# EasyEDA schematic SCH_6502 copy_2025-03-02.json
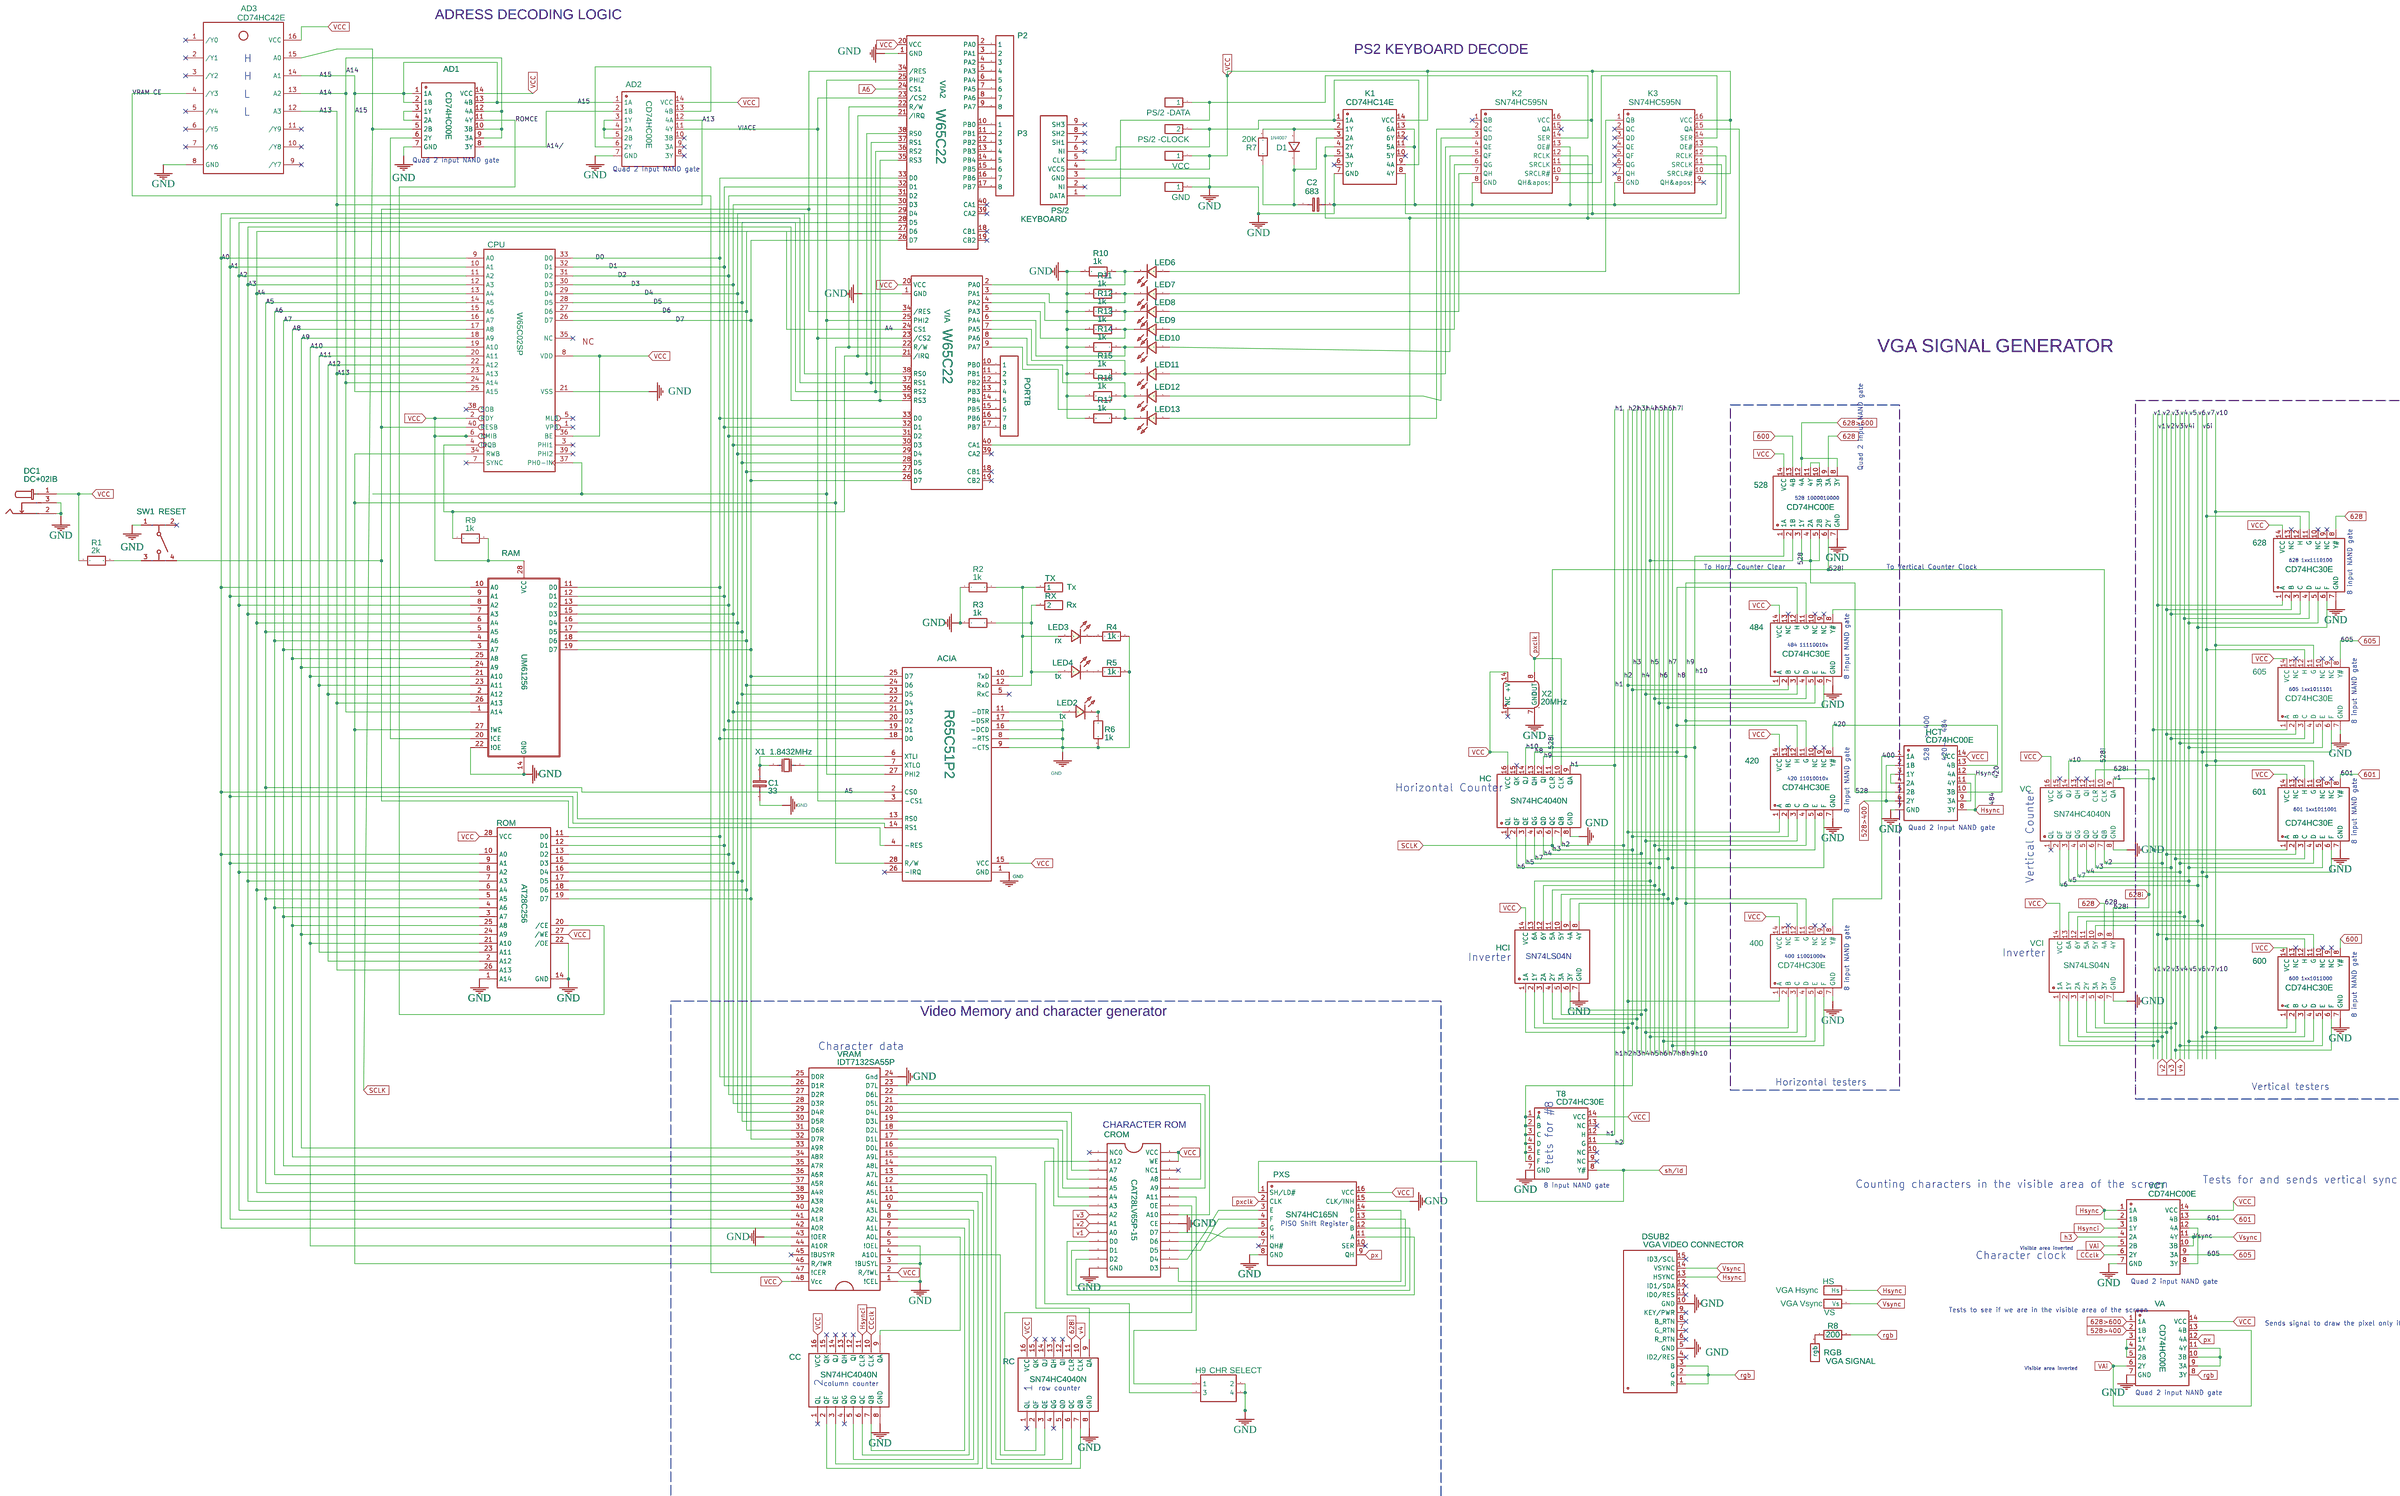
[diagram p0: schematic sheet]

## Parts
400  CD74HC30E  [DIP-14_L19.0-W7.0-P2.54-LS7.6-BL]
420  CD74HC30E  [DIP-14_L19.0-W7.0-P2.54-LS7.6-BL]
484  CD74HC30E  [DIP-14_L19.0-W7.0-P2.54-LS7.6-BL]
528  CD74HC00E  [DIP14]
600  CD74HC30E  [DIP-14_L19.0-W7.0-P2.54-LS7.6-BL]
601  CD74HC30E  [DIP-14_L19.0-W7.0-P2.54-LS7.6-BL]
605  CD74HC30E  [DIP-14_L19.0-W7.0-P2.54-LS7.6-BL]
628  CD74HC30E  [DIP-14_L19.0-W7.0-P2.54-LS7.6-BL]
ACIA  R65C51P2  [DIP28-600]
AD1  CD74HC00E  [DIP14]
AD2  CD74HC00E  [DIP14]
AD3  CD74HC42E  [DIP16-2.54-19.2X7.62MM]
C1  33  [RAD-0.2]
C2  683  [RAD-0.2]
CC  SN74HC4040N  [DIP254P762X508-16]
CLK  PS/2 -CLOCK  [HDR-M-2.54_1X1]
CPU  W65C02SP  [DIP-40]
CROM  CAT28LV65P-15  [DIP-28]
D1  1N4007  [DO-41_BD2.4-L4.7-P8.70-D0.9-RD]
DATA  PS/2 -DATA  [HDR-M-2.54_1X1]
DC1  DC+02IB  [AUDIO-SMD_DC-02IB]
DSUB2  VGA VIDEO CONNECTOR  [VGA-002]
GND  GND  [HDR-M-2.54_1X1]
H9  CHR SELECT  [HDR-F-2.54_2X2]
HC  SN74HC4040N  [DIP16]
HCI  U39  [PDIP-14_L19.7-W6.6-P2.54-LS8.3-BL]
HCT  CD74HC00E  [DIP14]
HS  VGA Hsync  [HDR-M-2.54_1X1]
K1  CD74HC14E  [DIP14]
K2  SN74HC595N  [DIP-16_L19.8-W6.5-P2.54-LS7.6-BL]
K3  SN74HC595N  [DIP-16_L19.8-W6.5-P2.54-LS7.6-BL]
KEYBOARD  PS/2  [PS2 FEMALE]
LED2  tx  [LED-TH_BD3.0_RED]
LED3  rx  [LED-TH_BD3.0_BLUE]
LED4  tx  [LED-TH_BD3.0_RED]
LED6  LED-TH-3mm_R  [LED-TH_BD3.0_RED]
LED7  LED-TH-3mm_R  [LED-TH_BD3.0_RED]
LED8  LED-TH-3mm_R  [LED-TH_BD3.0_RED]
LED9  LED-TH-3mm_R  [LED-TH_BD3.0_RED]
LED10  LED-TH-3mm_R  [LED-TH_BD3.0_RED]
LED11  LED-TH-3mm_R  [LED-TH_BD3.0_RED]
LED12  LED-TH-3mm_R  [LED-TH_BD3.0_RED]
LED13  LED-TH-3mm_R  [LED-TH_BD3.0_RED]
P2  HDR-F-2.54_1x8  [HDR-F-2.54_1X8]
P3  P3  [HDR-F-2.54_1X8]
PORTB  HDR-F-2.54_1x8  [HDR-F-2.54_1X8]
PXS  SN74HC165N  [DIP-16_L19.8-W6.5-P2.54-LS7.6-BL]
R1  2k  [R_AXIAL-0.4]
R2  1k  [R_AXIAL-0.3]
R3  1k  [R_AXIAL-0.3]
R4  1k  [R_AXIAL-0.4]
R5  1k  [R_AXIAL-0.4]
R6  1k  [R_AXIAL-0.4]
R7  20K  [R_AXIAL-0.4]
R8  200  [R_AXIAL-0.4]
R9  1k  [R_AXIAL-0.3]
R10  1k  [R_AXIAL-0.4]
R11  1k  [R_AXIAL-0.4]
R12  1k  [R_AXIAL-0.4]
R13  1k  [R_AXIAL-0.4]
R14  1k  [R_AXIAL-0.4]
R15  1k  [R_AXIAL-0.4]
R16  1k  [R_AXIAL-0.4]
R17  1k  [R_AXIAL-0.4]
RAM  UM61256  [DIP-28_300MIL]
RC  SN74HC4040N  [DIP254P762X508-16]
RGB  VGA SIGNAL  [HDR-M-2.54_1X1]
ROM  AT28C256  [AT28C256]
RX  Rx  [HDR-M-2.54_1X1]
SW1  RESET  [SW-TH_4P-L6.0-W6.0-P4.50-LS6.1]
T8  CD74HC30E  [DIP-14_L19.0-W7.0-P2.54-LS7.6-BL]
TX  Tx  [HDR-M-2.54_1X1]
VA  CD74HC00E  [DIP14]
VC  SN74HC4040N  [DIP16]
VCC  VCC  [HDR-M-2.54_1X1]
VCI  SN74LS04N  [PDIP-14_L19.7-W6.6-P2.54-LS8.3-BL]
VCT  CD74HC00E  [DIP14]
VIA  W65C22  [DIP-40_W15.24MM_LONGPADS_OWN]
VIA2  W65C22  [DIP-40_W15.24MM_LONGPADS_OWN]
VRAM  IDT7132SA55P  [DIP-48_W15.24MM_LONGPADS]
VS  VGA Vsync  [HDR-M-2.54_1X1]
X1  1.8432MHz  [OSC-TH_L10.0-W4.5-P5.00]
X2  20MHz  [OSCILLATOR_DIP-14]

## Library data of the parts
400 420 484 600 601 605 628 T8 = CD74HC30E: Supplier: LCSC; Supplier Part: C133818; Manufacturer: Texas Instruments; Contributor: LCSC; JLCPCB Part Class: Extended Part
528 AD1 AD2 HCT VA VCT = CD74HC00E
ACIA = R6551_ACIA copy: Manufacturer Part: 6551 ACIA; Contributor: MCCreeper8890
AD3 = CD74HC42E: Contributor: Károly Elekes
C1 C2 = C_RAD-0.2_EU: Contributor: LCEDA_Lib
CC RC = SN74HC4040N: Contributor: Niels Tatters
CLK DATA GND HS RGB RX TX VCC VS = HDR-M-2.54_1x1: Supplier Part: C81276; Supplier: LCSC; Contributor: LCEDA_Lib
CPU = W65C02SP
CROM = CAT28C64AP-20: Manufacturer: CATALYST SEMICONDUCTOR INC.; Supplier: eBay; Contributor: Felix Hower
D1 = 1N4007: Supplier: LCSC; Manufacturer: SEMTECH; Supplier Part: C106903; Contributor: LCEDA_Lib
DC1 = DC+02IB: Supplier: LCSC; Supplier Part: C718035; Manufacturer: JINJIA(金佳); JLCPCB Part Class: Extended Part; Contributor: LCSC
DSUB2 = VGA VIDEO CONNECTOR: Contributor: PixelCircuit
H9 = HDR-F-2.54_2x2: Supplier Part: C239342; Supplier: LCSC; Contributor: LCEDA_Lib
HC VC = SN74HC4040N
HCI VCI = SN74LS04N: Supplier: LCSC; Supplier Part: C183657; Manufacturer: Texas Instruments; Contributor: LCSC; JLCPCB Part Class: Extended Part
K1 = CD74HC14E
K2 K3 = SN74HC595N: Supplier: LCSC; Manufacturer: TI; Supplier Part: C78711; JLCPCB Part Class: Extended Part
KEYBOARD = PS/2: Supplier: LCSC; Contributor: PPaul63
LED2 LED4 LED6-LED13 = LED-TH-3mm_R: Manufacturer: EVERLIGHT(台湾亿光); Manufacturer Part: 204-10SDRD/S530-A3-L; Supplier Part: C84774; Supplier: LCSC; Contributor: LCEDA_Lib
LED3 = LED-TH-3mm_B: Manufacturer: EVERLIGHT(台湾亿光); Manufacturer Part: 204-10SUBC/S400-A4; Supplier Part: C86881; Supplier: LCSC; Contributor: LCEDA_Lib
P2 P3 PORTB = HDR-F-2.54_1x8: Supplier Part: C225505; Supplier: LCSC; Contributor: LCEDA_Lib
PXS = SN74HC165N: Supplier: LCSC; Manufacturer: TI; Supplier Part: C2909; JLCPCB Part Class: Extended Part
R1 R4-R8 R10-R17 = R_AXIAL-0.4_EU: Contributor: LCEDA_Lib
R2 R3 = R_AXIAL-0.3_EU: Contributor: LCEDA_Lib
R9 = R_AXIAL-0.3_EU: Contributor: LCEDA_Lib; Package Display: No
RAM = UM61256: Contributor: angarsk.forex
ROM = AT28C256: Contributor: doctor720.com
SW1 = Button-6x6x6mm: Supplier Part: C71836; Supplier: LCSC; Manufacturer: BBJ; Manufacturer Part: Switch,6*6*6Plastic head,260G, 0.25mm,Straight line
VIA VIA2 = W65C22 VIA: Manufacturer: Western Design Center; Manufacturer Part: W65C02S; Contributor: Lucoa_Quetz
VRAM = IDT7132SA55P: Contributor: alistair.roe66
X1 = X49UD18432MSD2SC-1: Supplier: LCSC; Manufacturer: YXC; Supplier Part: C2179; JLCPCB Part Class: Extended Part
X2 = AXE25-50-10-4F-5.000MHz: Contributor: digaetano.gemrad; license: https://www.gnu.org/licenses/lgpl-2.1.html

## Nets
GND: 400.7(GND) 420.7(GND) 484.7(GND) 528.7(GND) 600.7(GND) 601.7(GND) 605.7(GND) 628.7(GND) ACIA.1(GND) ACIA.8(-RTS) ACIA.9(-CTS) ACIA.16(-DCD) ACIA.17(-DSR) AD1.7(GND) AD2.7(GND) AD3.8(GND) C1.1 C2.2 CC.8(GND) CPU.21(VSS) CROM.14(GND) CROM.20(CE) DC1.2 DC1.3 DSUB2.5(GND) DSUB2.10(GND) GND.1 H9.2 H9.4 HC.8(GND) HCI.7(GND) HCT.7(GND) K1.7(GND) K1.11(5A) K1.13(6A) K2.8(GND) K2.13(OE#) K3.8(GND) K3.13(OE#) KEYBOARD.3(GND) PXS.8(GND) PXS.15(CLK/INH) R2.1 R3.1 R4.2 R5.2 R6.2 R10.1 R11.1 R12.1 R13.1 R14.1 R15.1 R16.1 R17.1 RAM.14(GND) RAM.22(!OE) RC.8(GND) ROM.1(A14) ROM.14(GND) ROM.22(/OE) SW1.1 T8.7(GND) VA.7(GND) VC.8(GND) VCI.7(GND) VCT.7(GND) VIA.1(GND) VIA2.1(GND) VRAM.1(!CEL) VRAM.3(!BUSYL) VRAM.5(!OEL) VRAM.24(Gnd) VRAM.43(!OER) X2.7(GND)
v1: 601.1(A) 605.1(A) CROM.10(A0) VC.9(QA) VCI.1(1A)
v1i: 600.11(G) 628.1(A) VCI.2(1Y)
v2: CROM.9(A1) VC.7(QB) VCI.3(2A)
v2i: 600.12(H) 601.2(B) 605.2(B) 628.2(B) VCI.4(2Y)
v3: 605.3(C) 628.3(C) CROM.8(A2) VC.6(QC) VCI.5(3A)
v3i: 600.6(F) 601.3(C) VCI.6(3Y)
v4: 600.5(E) 601.4(D) 605.4(D) RC.10(CLK) VC.5(QD) VCI.13(6A)
v4i: 628.4(D) VCI.12(6Y)
v5: 600.4(D) 601.5(E) 605.5(E) 628.5(E) VC.3(QE)
v6: 628.6(F) VC.2(QF) VCI.11(5A)
v6i: 600.3(C) 601.6(F) 605.6(F) VCI.10(5Y)
v7: 600.2(B) 601.12(H) 605.12(H) 628.12(H) VC.4(QG)
v10: 600.1(A) 601.11(G) 605.11(G) 628.11(G) VC.14(QJ)
VCC: 400.14(VCC) 420.14(VCC) 484.14(VCC) 528.14(VCC) 600.14(VCC) 601.14(VCC) 605.14(VCC) 628.14(VCC) ACIA.15(VCC) AD1.14(VCC) AD2.14(VCC) AD3.16(VCC) CC.16(VCC) CPU.2(RDY) CPU.6(NMIB) CPU.8(VDD) CPU.36(BE) CROM.27(WE) CROM.28(VCC) DC1.1 HC.16(VCC) HCI.14(VCC) HCT.14(VCC) K1.14(VCC) K2.10(SRCLR#) K2.16(VCC) K3.10(SRCLR#) K3.16(VCC) KEYBOARD.4(VCC5) PXS.16(VCC) R1.1 R9.2 RAM.28(VCC) RC.16(VCC) ROM.27(/WE) ROM.28(VCC) T8.14(VCC) VA.14(VCC) VC.16(VCC) VCC.1 VCI.14(VCC) VCT.14(VCC) VIA.20(VCC) VIA2.20(VCC) VRAM.2(R/!WL) VRAM.48(Vcc) X2.14(+V)
400: 400.8(Y#) HCT.1(1A)
420: 420.8(Y#) HCT.13(4B)
484: 484.8(Y#) HCT.10(3B)
528: 528.3(1Y) 528.4(2A) 528.5(2B) HCT.5(2B)
528>400: HCT.2(1B) HCT.6(2Y) VA.2(1B)
528i: 528.6(2Y) HC.11(CLR) VC.10(CLK)
600: 528.13(4B) 600.8(Y#)
601: 601.8(Y#) VCT.13(4B)
605: 605.8(Y#) VCT.9(3A)
628: 528.9(3A) 628.8(Y#) VCI.9(4A)
628>600: 528.8(3Y) 528.12(4A) VA.1(1A)
628i: RC.11(CLR) VC.11(CLR) VCI.8(4Y)
A0: ACIA.13(RS0) CPU.9(A0) RAM.10(A0) ROM.10(A0) VIA.38(RS0) VIA2.38(RS0) VRAM.42(A0R)
A1: ACIA.14(RS1) CPU.10(A1) RAM.9(A1) ROM.9(A1) VIA.37(RS1) VIA2.37(RS1) VRAM.41(A1R)
A2: CPU.11(A2) RAM.8(A2) ROM.8(A2) VIA.36(RS2) VIA2.36(RS2) VRAM.40(A2R)
A3: CPU.12(A3) RAM.7(A3) ROM.7(A3) VIA.35(RS3) VIA2.35(RS3) VRAM.39(A3R)
A4: CPU.13(A4) RAM.6(A4) ROM.6(A4) VIA.24(CS1) VRAM.38(A4R)
A5: ACIA.2(CS0) CPU.14(A5) RAM.5(A5) ROM.5(A5) VRAM.37(A5R)
A6: CPU.15(A6) RAM.4(A6) ROM.4(A6) VIA2.24(CS1) VRAM.36(A6R)
A7: CPU.16(A7) RAM.3(A7) ROM.3(A7) VRAM.35(A7R)
A8: CPU.17(A8) RAM.25(A8) ROM.25(A8) VRAM.34(A8R)
A9: CPU.18(A9) RAM.24(A9) ROM.24(A9) VRAM.33(A9R)
A10: CPU.19(A10) RAM.21(A10) ROM.21(A10) VRAM.44(A10R)
A11: CPU.20(A11) RAM.23(A11) ROM.23(A11)
A12: CPU.22(A12) RAM.2(A12) ROM.2(A12)
A13: AD2.12(4A) AD3.12(A3) CPU.23(A13) RAM.26(A13) ROM.26(A13)
A14: AD1.9(3A) AD1.10(3B) AD1.12(4A) AD3.13(A2) CPU.24(A14) RAM.1(A14)
A14/: AD1.8(3Y) AD2.2(1B)
A15: AD1.1(1A) AD1.2(1B) AD1.13(4B) AD2.1(1A) AD3.14(A1) CPU.25(A15)
CCclk: CC.10(CLK) VCT.6(2Y)
D0: ACIA.18(D0) CPU.33(D0) RAM.11(D0) ROM.11(D0) VIA.33(D0) VIA2.33(D0) VRAM.25(D0R)
D1: ACIA.19(D1) CPU.32(D1) RAM.12(D1) ROM.12(D1) VIA.32(D1) VIA2.32(D1) VRAM.26(D1R)
D2: ACIA.20(D2) CPU.31(D2) RAM.13(D2) ROM.13(D2) VIA.31(D2) VIA2.31(D2) VRAM.27(D2R)
D3: ACIA.21(D3) CPU.30(D3) RAM.15(D3) ROM.15(D3) VIA.30(D3) VIA2.30(D3) VRAM.28(D3R)
D4: ACIA.22(D4) CPU.29(D4) RAM.16(D4) ROM.16(D4) VIA.29(D4) VIA2.29(D4) VRAM.29(D4R)
D5: ACIA.23(D5) CPU.28(D5) RAM.17(D5) ROM.17(D5) VIA.28(D5) VIA2.28(D5) VRAM.30(D5R)
D6: ACIA.24(D6) CPU.27(D6) RAM.18(D6) ROM.18(D6) VIA.27(D6) VIA2.27(D6) VRAM.31(D6R)
D7: ACIA.25(D7) CPU.26(D7) RAM.19(D7) ROM.19(D7) VIA.26(D7) VIA2.26(D7) VRAM.32(D7R)
h1: HC.9(QA) T8.12(H)
h2: HC.7(QB) HCI.1(1A) T8.11(G)
h2i: 400.1(A) 420.1(A) 484.1(A) HCI.2(1Y)
h3i: 400.2(B) HCI.4(2Y)
h4: HC.5(QD) HCI.5(3A)
h4i: 400.3(C) 420.3(C) 484.3(C) HCI.6(3Y)
h5: 400.4(D) 528.2(1B) HC.3(QE) HCI.13(6A)
h5i: 420.4(D) 484.4(D) HCI.12(6Y)
h6: 420.5(E) 484.5(E) HC.2(QF) HCI.11(5A)
h6i: 400.5(E) HCI.10(5Y)
h7: 484.6(F) HC.4(QG) HCI.9(4A)
h7i: 400.6(F) 420.6(F) HCI.8(4Y)
h8: 400.11(G) 420.12(H) 484.12(H) HC.13(QH)
h9: 400.12(H) 420.11(G) 484.11(G) HC.12(QI)
h10: 528.1(1A) HC.14(QJ)
Hsync: DSUB2.13(HSYNC) HCT.8(3Y) HCT.12(4A) HS.1(Hs) VCT.1(1A) VCT.2(1B)
Hsynci: CC.11(CLR) VCT.3(1Y)
px: PXS.9(QH) VA.12(4A)
pxclk: HC.10(CLK) PXS.2(CLK) X2.8(OUT)
rgb: DSUB2.1(R) DSUB2.2(G) DSUB2.3(B) R8.2 VA.8(3Y)
ROMCE: AD1.11(4Y) ROM.20(/CE)
SCLK: 420.2(B) 484.2(B) AD1.5(2B) AD3.15(A0) HC.6(QC) HCI.3(2A) T8.1(A) T8.2(B) T8.3(C) T8.4(D) T8.5(E) T8.6(F) VCT.4(2A)
sh/ld: PXS.1(SH/LD#) T8.8(Y#)
VAi: VA.6(2Y) VA.13(4B) VCT.5(2B)
VIACE: ACIA.3(-CS1) AD2.11(4Y) VIA.23(/CS2) VIA2.23(/CS2)
VRAM CE: AD3.4(/Y3) VRAM.47(!CER)
Vsync: DSUB2.14(VSYNC) VCT.10(3B) VCT.11(4Y) VS.1(Vs)
Net-(528-10): 528.10(3B) 528.11(4Y)
Net-(ACIA-4): ACIA.4(-RES) CPU.40(RESB) SW1.4 VIA.34(/RES) VIA2.34(/RES)
Net-(ACIA-6): ACIA.6(XTLI) C1.2 X1.2(OSC2)
Net-(ACIA-7): ACIA.7(XTLO) X1.1(OSC1)
Net-(ACIA-10): ACIA.10(TxD) LED3.1 R2.2 TX.1
Net-(ACIA-11): ACIA.11(-DTR) LED2.1
Net-(ACIA-12): ACIA.12(RxD) LED4.1 R3.2 RX.1(2)
Net-(ACIA-27): ACIA.27(PHI2) CPU.37(PH0-IN) VIA.25(PHI2) VIA2.25(PHI2)
Net-(ACIA-28): ACIA.28(R/W) CPU.34(RWB) RAM.27(!WE) VIA.22(R/W) VIA2.22(R/W) VRAM.46(R/!WR)
Net-(AD1-3): AD1.3(1Y) AD1.4(2A)
Net-(AD1-6): AD1.6(2Y) RAM.20(!CE)
Net-(AD2-3): AD2.3(1Y) AD2.4(2A) AD2.5(2B)
Net-(AD2-6): AD2.6(2Y) AD2.13(4B)
Net-(C2-1): C2.1 D1.1 K1.3(2A) R7.2
Net-(CC-2): CC.2(QF) VRAM.11(A5L)
Net-(CC-3): CC.3(QE) VRAM.10(A4L)
Net-(CC-5): CC.5(QD) VRAM.9(A3L)
Net-(CC-6): CC.6(QC) VRAM.8(A2L)
Net-(CC-7): CC.7(QB) VRAM.7(A1L)
Net-(CC-9): CC.9(QA) VRAM.6(A0L)
Net-(CLK-1): CLK.1(2) K1.1(1A) K1.9(4A) KEYBOARD.5(CLK)
Net-(CPU-4): CPU.4(IRQB) R9.1 VIA.21(/IRQ) VIA2.21(/IRQ)
Net-(CROM-2): CROM.2(A12) H9.3
Net-(CROM-3): CROM.3(A7) VRAM.20(D4L)
Net-(CROM-4): CROM.4(A6) VRAM.19(D3L)
Net-(CROM-5): CROM.5(A5) VRAM.18(D2L)
Net-(CROM-6): CROM.6(A4) VRAM.17(D1L)
Net-(CROM-7): CROM.7(A3) VRAM.16(D0L)
Net-(CROM-11): CROM.11(D0) PXS.11(A)
Net-(CROM-12): CROM.12(D1) PXS.12(B)
Net-(CROM-13): CROM.13(D2) PXS.13(C)
Net-(CROM-15): CROM.15(D3) PXS.14(D)
Net-(CROM-16): CROM.16(D4) PXS.3(E)
Net-(CROM-17): CROM.17(D5) PXS.4(F)
Net-(CROM-18): CROM.18(D6) PXS.5(G)
Net-(CROM-19): CROM.19(D7) PXS.6(H)
Net-(CROM-21): CROM.21(A10) VRAM.23(D7L)
Net-(CROM-22): CROM.22(OE) RC.2(QF)
Net-(CROM-23): CROM.23(A11) H9.1
Net-(CROM-24): CROM.24(A9) VRAM.22(D6L)
Net-(CROM-25): CROM.25(A8) VRAM.21(D5L)
Net-(D1-2): D1.2 K1.2(1Y) R7.1
Net-(DATA-1): DATA.1 K2.14(SER) KEYBOARD.1(DATA)
Net-(HCT-3): HCT.3(1Y) HCT.4(2A)
Net-(HCT-9): HCT.9(3A) HCT.11(4Y)
Net-(K1-4): K1.4(2Y) K1.5(3A) K2.12(RCLK) K3.12(RCLK) VIA.40(CA1)
Net-(K1-8): K1.8(4Y) K2.11(SRCLK) K3.11(SRCLK)
Net-(K2-2): K2.2(QC) LED13.1
Net-(K2-3): K2.3(QD) LED12.1
Net-(K2-4): K2.4(QE) LED11.1
Net-(K2-5): K2.5(QF) LED10.1
Net-(K2-6): K2.6(QG) LED9.1
Net-(K2-7): K2.7(QH) LED8.1
Net-(K2-9): K2.9(QH') K3.14(SER)
Net-(K3-1): K3.1(QB) LED6.1
Net-(K3-15): K3.15(QA) LED7.1
Net-(LED2-2): LED2.2 R6.1
Net-(LED3-2): LED3.2 R4.1
Net-(LED4-2): LED4.2 R5.1
Net-(LED6-2): LED6.2 R10.2 VIA.2(PA0)
Net-(LED7-2): LED7.2 R11.2 VIA.3(PA1)
Net-(LED8-2): LED8.2 R12.2 VIA.4(PA2)
Net-(LED9-2): LED9.2 R13.2 VIA.5(PA3)
Net-(LED10-2): LED10.2 R14.2 VIA.6(PA4)
Net-(LED11-2): LED11.2 R15.2 VIA.7(PA5)
Net-(LED12-2): LED12.2 R16.2 VIA.8(PA6)
Net-(LED13-2): LED13.2 R17.2 VIA.9(PA7)
Net-(P2-1): P2.1 VIA2.2(PA0)
Net-(P2-2): P2.2 VIA2.3(PA1)
Net-(P2-3): P2.3 VIA2.4(PA2)
Net-(P2-4): P2.4 VIA2.5(PA3)
Net-(P2-5): P2.5 VIA2.6(PA4)
Net-(P2-6): P2.6 VIA2.7(PA5)
Net-(P2-7): P2.7 VIA2.8(PA6)
Net-(P2-8): P2.8 VIA2.9(PA7)
Net-(P3-1): P3.1 VIA2.10(PB0)
Net-(P3-2): P3.2 VIA2.11(PB1)
Net-(P3-3): P3.3 VIA2.12(PB2)
Net-(P3-4): P3.4 VIA2.13(PB3)
Net-(P3-5): P3.5 VIA2.14(PB4)
Net-(P3-6): P3.6 VIA2.15(PB5)
Net-(P3-7): P3.7 VIA2.16(PB6)
Net-(P3-8): P3.8 VIA2.17(PB7)
Net-(PORTB-1): PORTB.1 VIA.10(PB0)
Net-(PORTB-2): PORTB.2 VIA.11(PB1)
Net-(PORTB-3): PORTB.3 VIA.12(PB2)
Net-(PORTB-4): PORTB.4 VIA.13(PB3)
Net-(PORTB-5): PORTB.5 VIA.14(PB4)
Net-(PORTB-6): PORTB.6 VIA.15(PB5)
Net-(PORTB-7): PORTB.7 VIA.16(PB6)
Net-(PORTB-8): PORTB.8 VIA.17(PB7)
Net-(R1-2): R1.2 SW1.3
Net-(R8-1): R8.1 RGB.1(rgb)
Net-(RC-3): RC.3(QE) VRAM.4(A10L)
Net-(RC-5): RC.5(QD) VRAM.15(A9L)
Net-(RC-6): RC.6(QC) VRAM.14(A8L)
Net-(RC-7): RC.7(QB) VRAM.13(A7L)
Net-(RC-9): RC.9(QA) VRAM.12(A6L)
Net-(VA-3): VA.3(1Y) VA.4(2A) VA.5(2B)
Net-(VA-9): VA.9(3A) VA.10(3B) VA.11(4Y)
Net-(VCT-8): VCT.8(3Y) VCT.12(4A)

Not connected (* = marked no-connect by the designer): 400 9(NC)* 10(NC)* 13(NC)*; 420 9(NC)* 10(NC)* 13(NC)*; 484 9(NC)* 10(NC)* 13(NC)*; 600 9(NC)* 10(NC)* 13(NC)*; 601 9(NC)* 10(NC)* 13(NC)*; 605 9(NC)* 10(NC)* 13(NC)*; 628 9(NC)* 10(NC)* 13(NC)*; ACIA 5(RxC)* 26(-IRQ)*; AD2 8(3Y)* 9(3A)* 10(3B)*; AD3 1(/Y0)* 2(/Y1)* 3(/Y2)* 5(/Y4)* 6(/Y5)* 7(/Y6)* 9(/Y7)* 10(/Y8)* 11(/Y9)*; CC 1(QL)* 4(QG)* 12(QI)* 13(QH)* 14(QJ)* 15(QK)*; CPU 1(VPB)* 3(PHI1)* 5(MLB)* 7(SYNC)* 35(NC)* 38(SOB)* 39(PHI2)*; CROM 1(NC0)* 26(NC1)*; DSUB2 4(ID2/RES)* 6(R_RTN)* 7(G_RTN)* 8(B_RTN)* 9(KEY/PWR)* 11(ID0/RES)* 12(ID1/SDA)* 15(ID3/SCL)*; HC 1(QL)* 15(QK)*; K1 6(3Y)* 10(5Y)* 12(6Y)*; K2 1(QB)* 15(QA)*; K3 2(QC)* 3(QD)* 4(QE)* 5(QF)* 6(QG)* 7(QH)* 9(QH')*; KEYBOARD 2(NI)* 6(NI)* 7(SH1)* 8(SH2)* 9(SH3)*; PXS 7(QH#)* 10(SER)*; RC 1(QL)* 4(QG)* 12(QI)* 13(QH)* 14(QJ)* 15(QK)*; SW1 2*; T8 9(NC)* 10(NC)* 13(NC)*; VC 1(QL)* 12(QI)* 13(QH)* 15(QK)*; VIA 18(CB1)* 19(CB2)* 39(CA2)*; VIA2 18(CB1)* 19(CB2)* 39(CA2)* 40(CA1)*; VRAM 45(!BUSYR)*; X2 1(NC)*

## Notes on the sheet
- 6502 COMPUTER
- ADRESS DECODING LOGIC
- PS2 KEYBOARD DECODE
- H
- H
- L
- L
- Quad 2 input NAND gate
- Quad 2 input NAND gate
- VGA SIGNAL GENERATOR
- Quad 2 input NAND gate
- 528 1000010000
- 628 1xx1110100
- To Horz. Counter Clear
- To Vertical Counter Clock
- 8 input NAND gate
- 484 11110010x
- 8 input NAND gate
- 605 1xx1011101
- 8 input NAND gate
- 528 -> 400
- 420-> 484
- Horizontal Counter
- 420 11010010x
- 8 input NAND gate
- 601 1xx1011001
- Quad 2 input NAND gate
- 8 input NAND gate
- Vertical Counter
- Inverter
- Inverter
- SN74LS04N
- 400 11001000x
- 600 1xx1011000
- 8 input NAND gate
- Video Memory and character generator
- 8 input NAND gate
- Character data
- Horizontal testers
- Vertical testers
- CHARACTER ROM
- tets for #8
- 8 input NAND gate
- Counting characters in the visible area of the screen
- Tests for and sends vertical sync signal
- PISO Shift Register
- Character clock
- Visible area inverted
- Quad 2 input NAND gate
- Tests to see if we are in the visible area of the screen
- Sends signal to draw the pixel only if we are in the visible area of the screen
- Visible area inverted
- column counter
- 2
- 1
- row counter
- Quad 2 input NAND gate
